# EAGLE design tamatebako (EAGLE 7.6.0)
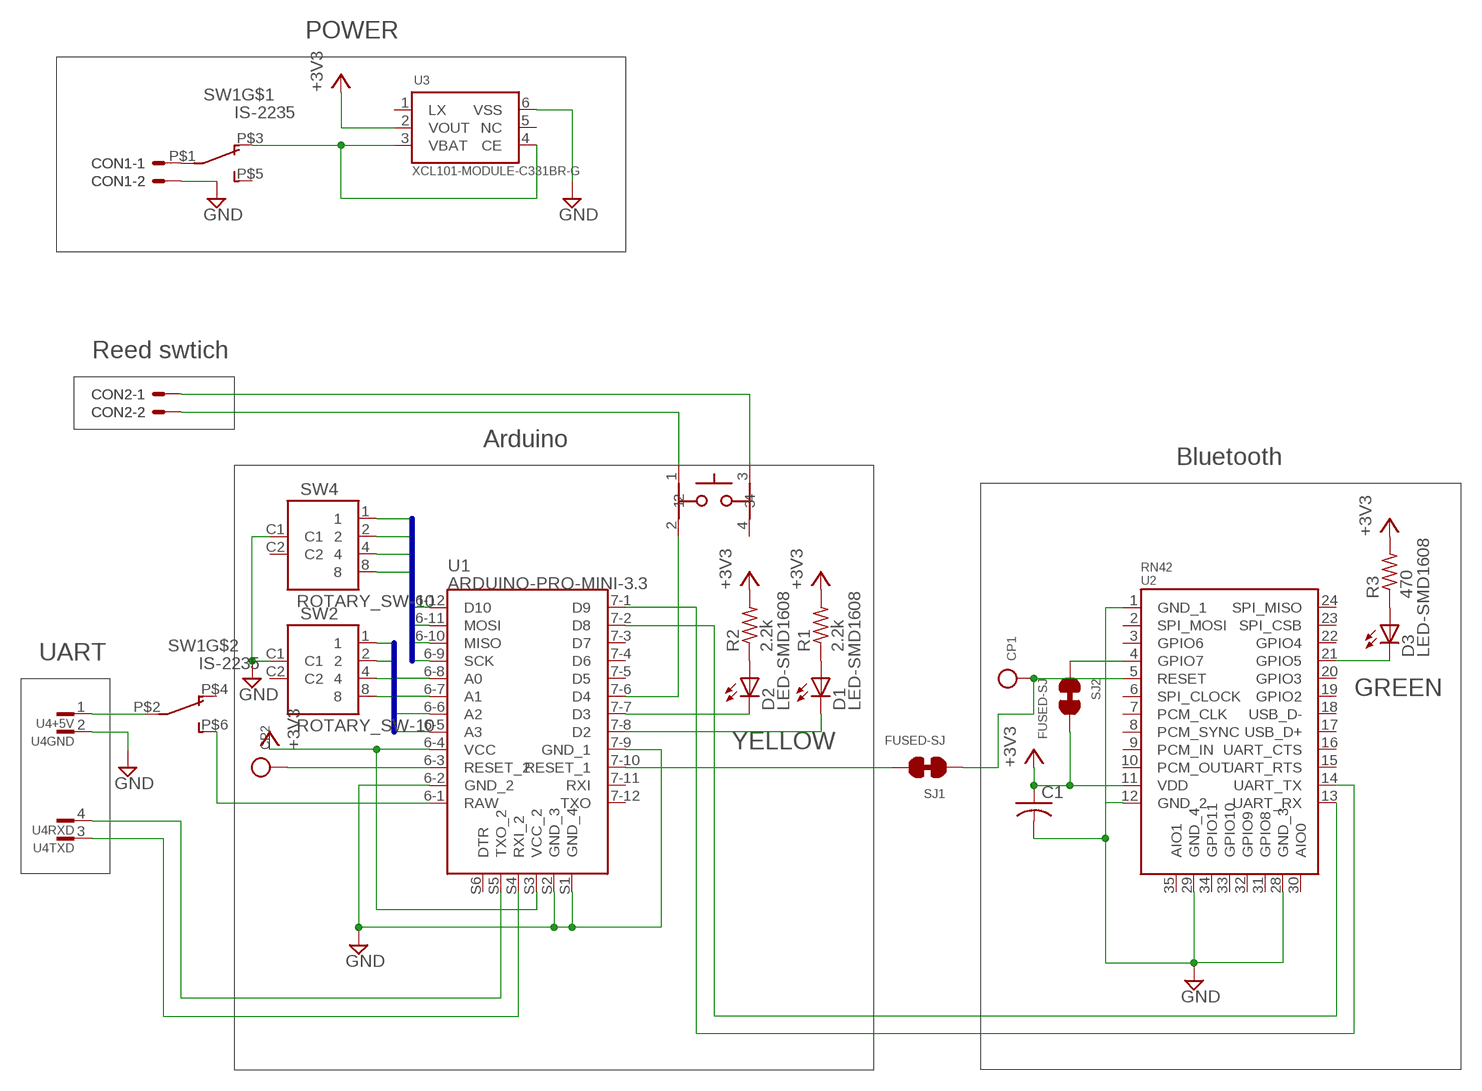
[diagram p0: schematic, sheet 1]

## Parts
C1  C-2012  [2012-C]
CON1  PH_CONNECTOR_2PIN  [PH_CONNECTOR_2PIN]
CON2  PH_CONNECTOR_2PIN  [PH_CONNECTOR_2PIN]
CP1  SST-1-2  [SST-1-2]
CP2  SST-1-2  [SST-1-2]
D1  LED-SMD1608  [D1608]
D2  LED-SMD1608  [D1608]
D3  LED-SMD1608  [D1608]
R1  2.2k  R-2012  [2012-R]
R2  2.2k  R-2012  [2012-R]
R3  470  R-2012  [2012-R]
SJ1  FUSED-SJ  [FUSED-SJ]
SJ2  FUSED-SJ  [FUSED-SJ]
SW1  IS-2235  [IS-2235]
SW2  ROTARY_SW-10  [ROTARY_SW]
SW3  PUSHSW  [PUSHSW]
SW4  ROTARY_SW-10  [ROTARY_SW]
U1  ARDUINO-PRO-MINI-3.3  [ARDUINO_PRO_MINI]
U2  RN42  [RN42]
U3  XCL101-MODULE-C331BR-G  [XCL101-MODULE]
U4  UART_MODULE  [MICRO_USB_SERIAL_MODULE]

## Nets
+3V3: C1.1 R1.2 R2.2 R3.2 SJ2.2 U1.6-4(VCC) U1.S3(VCC_2) U2.11(VDD) U3.2(VOUT)
GND: C1.2 CON1.2 SW2.C1 SW4.C1 U1.6-2(GND_2) U1.7-9(GND_1) U1.S1(GND_4) U1.S2(GND_3) U2.1(GND_1) U2.12(GND_2) U2.28(GND_3) U2.29(GND_4) U3.6(VSS) U4.2
LOWER0: SW2.1 U1.6-8(A0)
LOWER1: SW2.2 U1.6-7(A1)
LOWER2: SW2.4 U1.6-6(A2)
LOWER3: SW2.8 U1.6-5(A3)
N$1: CON1.1 SW1.P$1(P)
N$2: SW1.P$3(O) U3.3(VBAT) U3.4(CE)
N$3: CP1.1(SIGNAL) SJ1.1 U2.5(RESET)
N$4: U1.S5(TXO_2) U4.4
N$5: U1.7-1(D9) U2.14(UART_TX)
N$6: D1.A R1.1
N$7: D2.A R2.1
N$8: U1.S4(RXI_2) U4.3
N$9: SW1.P$2(P) U4.1
N$10: SW1.P$6(S) U1.6-1(RAW)
N$11: D2.K U1.7-7(D3)
N$12: D1.K U1.7-8(D2)
N$13: SW3.2 U1.7-6(D4)
N$14: CON2.2 SW3.1
N$15: CON2.1 SW3.3
N$16: SJ2.1 U2.4(GPIO7)
N$17: D3.A R3.1
N$18: D3.K U2.21(GPIO5)
N$19: U1.7-2(D8) U2.13(UART_RX)
RESET_ARDUINO: SJ1.2 U1.7-10(RESET_1)
RESET_ARDUINO_2: CP2.1(SIGNAL) U1.6-3(RESET_2)
UPPER0: SW4.1 U1.6-12(D10)
UPPER1: SW4.2 U1.6-11(MOSI)
UPPER2: SW4.4 U1.6-10(MISO)
UPPER3: SW4.8 U1.6-9(SCK)
Unconnected: SW1.P$4(O) SW1.P$5(S) SW2.C2 SW3.4 SW4.C2 U1.7-3(D7) U1.7-4(D6) U1.7-5(D5) U1.7-11(RXI) U1.7-12(TXO) U1.S6(DTR) U2.2(SPI_MOSI) U2.3(GPIO6) U2.6(SPI_CLOCK) U2.7(PCM_CLK) U2.8(PCM_SYNC) U2.9(PCM_IN) U2.10(PCM_OUT) U2.15(UART_RTS) U2.16(UART_CTS) U2.17(USB_D+) U2.18(USB_D-) U2.19(GPIO2) U2.20(GPIO3) U2.22(GPIO4) U2.23(SPI_CSB) U2.24(SPI_MISO) U2.30(AIO0) U2.31(GPIO8) U2.32(GPIO9) U2.33(GPIO10) U2.34(GPIO11) U2.35(AIO1) U3.1(LX) U3.5(NC)

## Buses
UPPER[0..3]
LOWER[0..3]

## Notes on the sheet
- POWER
- Reed swtich
- Arduino
- Bluetooth
- UART
- GREEN
- YELLOW

## Library data of the parts
C1 = Passive_Robotech:C
CON1 CON2 = Connector_Robotech:PH_CONNECTOR_2PIN: ph connector 2pin yeah
CP1 CP2 = Connector_Robotech:SST-1-2: Sunhayato logic checkpin SST-1-2
D1-D3 = Diode_Robotech:LED
R1-R3 = Passive_Robotech:R
SJ1 SJ2 = mylibrary:FUSED-SJ
SW1 = Passive_Robotech:IS-2235: 3-pin Slide Switch sold in akidzuki @100yen (2008/10/14)
SW2 SW4 = mylibrary:ROTARY_SW; RANGE: 0-9
SW3 = Passive_Robotech:PUSHSW
U1 = mylibrary:ARDUINO-PRO-MINI
U2 = mylibrary:RN42: Bluetooth module RN-42-I/RM by akizuki [link <http://akizukidenshi.com/catalog/g/gM-07612/>]
U3 = mylibrary:XCL101-MODULE
U4 = mylibrary:UART_MODULE

## Board
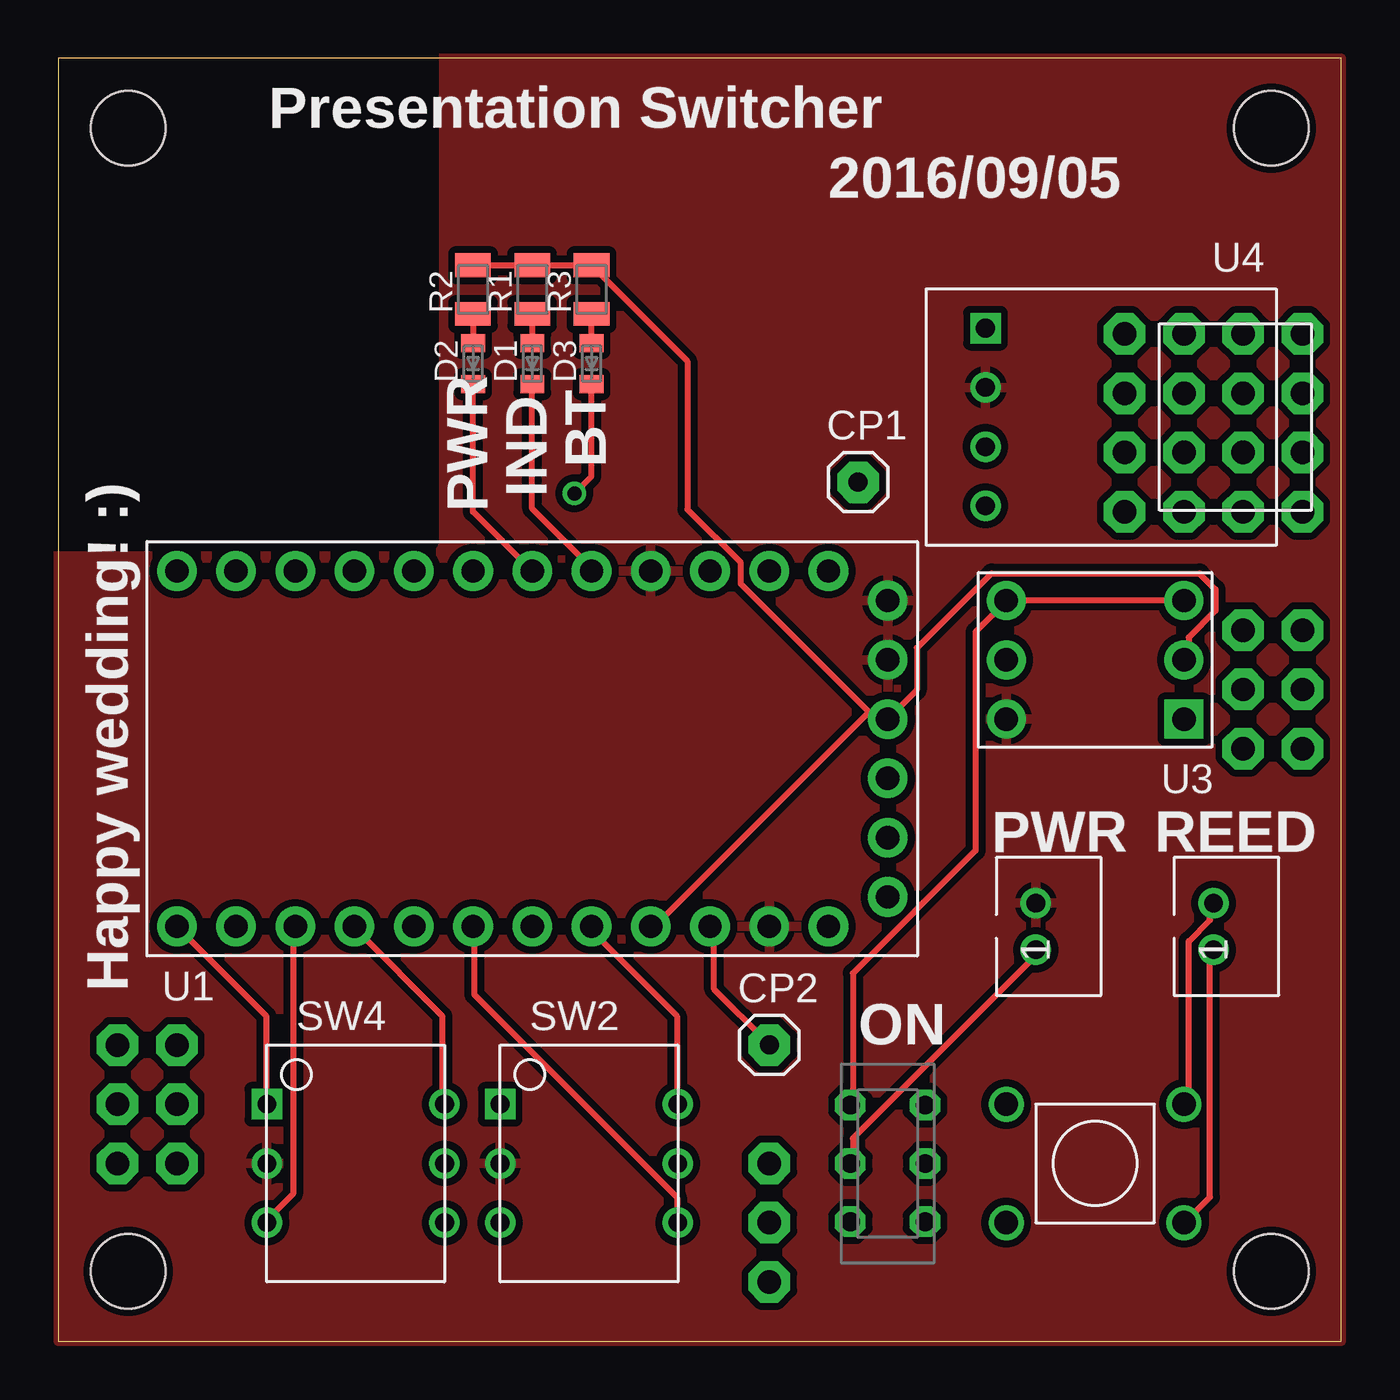
[diagram p1: board, top side]
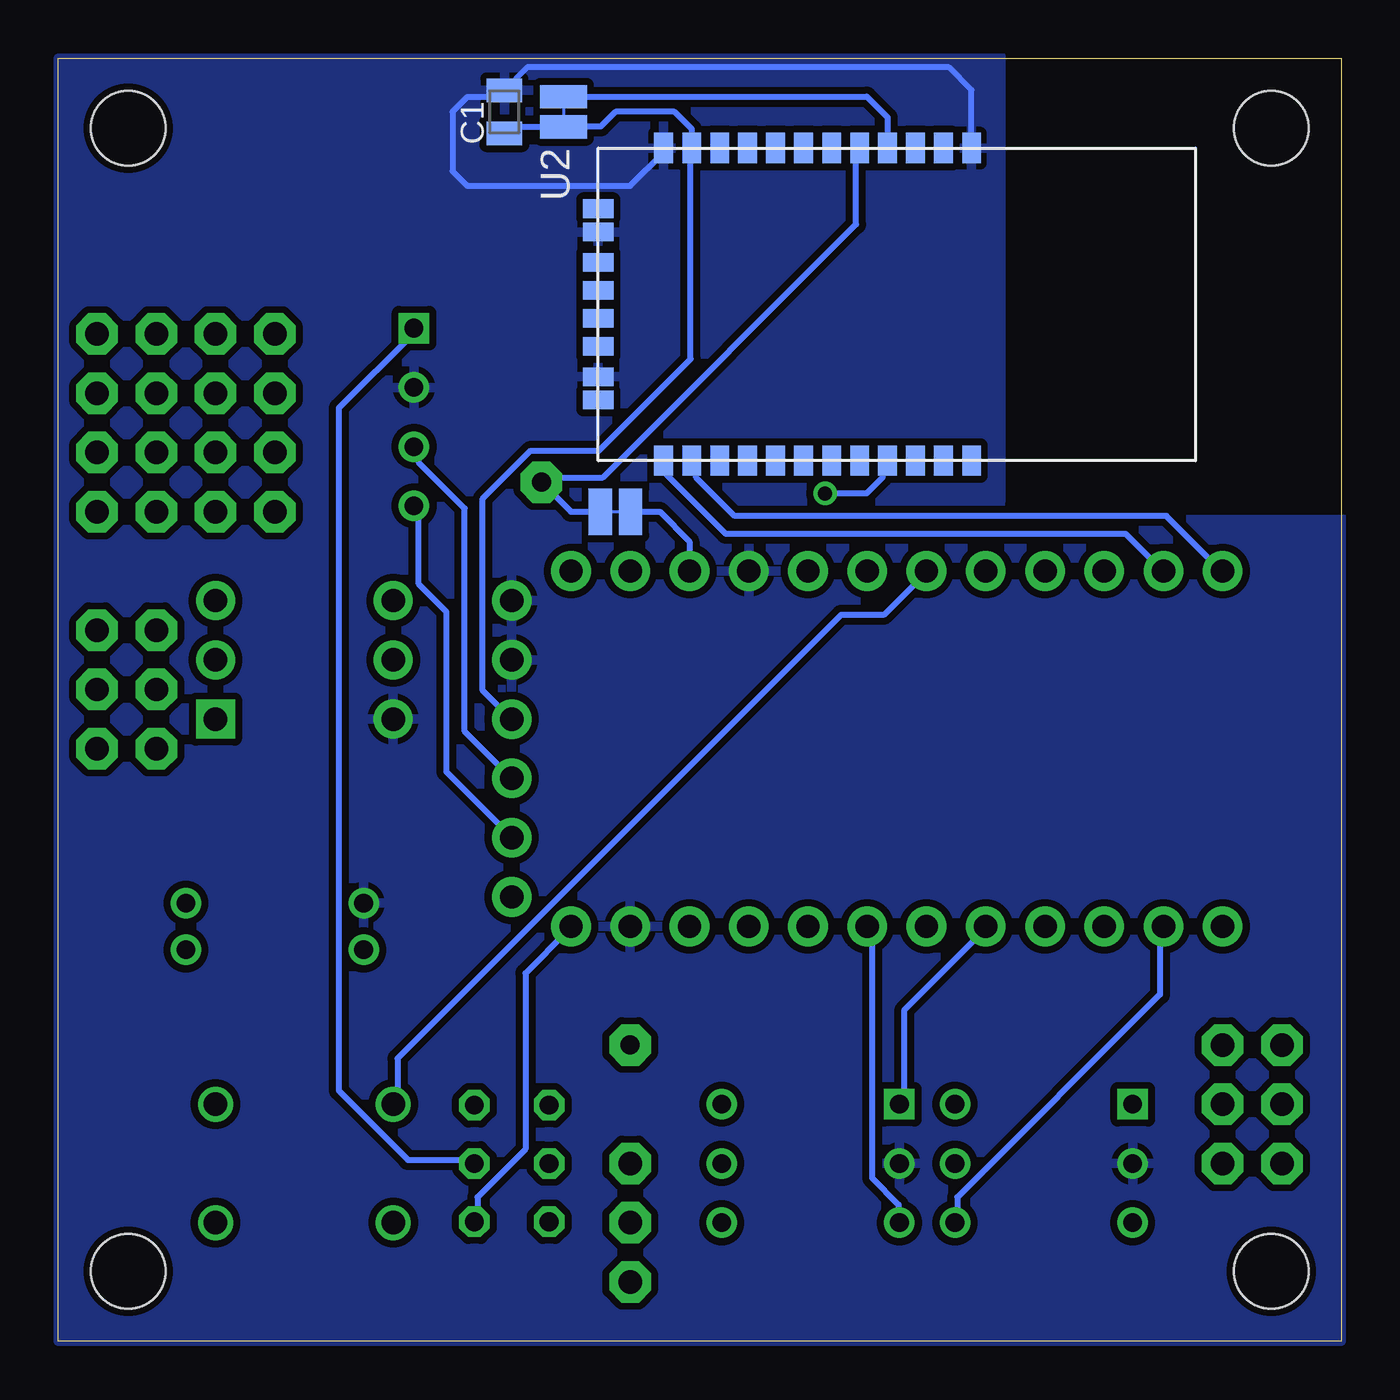
[diagram p2: board, bottom side, seen from below]

Size 55 x 55 mm. Coordinates in mm from the lower left corner, seen from the top.
Outline: 0,0 55,0 55,55 0,55 0,0
Copper layers (1*16): Top 0.0356mm / dielectric 1.5011mm / Bottom 0.0356mm
Design rules "formitaminimum": minimum track width 5mil, minimum drill 0.5994mm, track to track 0.2007mm, track to pad 0.2007mm, pad to pad 0.2007mm, via to via 0.2007mm, smd to smd 0mil, copper to edge 0mil, drill to drill 1mil, minimum pad ring 10mil, minimum via ring 8mil, stop-mask expansion 4mil, vias tented up to drill 0mil, thermal gap 10mil
Holes 3.2 mm at 3,3 52,3 52,52 3,52
tRestrict: area 0,34.3 to 15.9,55.2
bRestrict: area 0,35.9 to 14,55.2

### Footprints (pad centres in the part's own frame; a part is rotated, then mirrored left to right if it is on the bottom)
2012-C = smd 1.016 x 1.524: 1 -0.921,0; 2 0.921,0
PH_CONNECTOR_2PIN = drill 0.8: 1 -1,0; 2 1,0
SST-1-2 = drill 0.813 pad 1.778 octagon: 1 0,0
D1608 = smd 0.762 x 1.016: A 0.875,0; K -0.875,0
2012-R = smd 1.016 x 1.524: 1 -1.048,0; 2 1.048,0
FUSED-SJ = smd 1 x 2: 1 -0.65,0; 2 0.65,0
IS-2235 = drill 0.8 octagon: P$1 0,1.6; P$2 0,-1.6; P$3 2.5,1.6; P$4 2.5,-1.6; P$5 -2.5,1.6; P$6 -2.5,-1.6
ROTARY_SW = drill 0.8 square: 1 0,5.08 | drill 0.8: 2 7.62,0; 4 0,0; 8 7.62,5.08; C1 0,2.54; C2 7.62,2.54
PUSHSW = drill 1: 1 -2.54,3.81; 2 -2.54,-3.81; 3 2.54,3.81; 4 2.54,-3.81
ARDUINO_PRO_MINI = drill 1 pad 1.7: 6-1 -7.62,-11.43; 6-2 -7.62,-8.89; 6-3 -7.62,-6.35; 6-4 -7.62,-3.81; 6-5 -7.62,-1.27; 6-6 -7.62,1.27; 6-7 -7.62,3.81; 6-8 -7.62,6.35; 6-9 -7.62,8.89; 6-10 -7.62,11.43; 6-11 -7.62,13.97; 6-12 -7.62,16.51; 7-1 7.62,16.51; 7-2 7.62,13.97; 7-3 7.62,11.43; 7-4 7.62,8.89; 7-5 7.62,6.35; 7-6 7.62,3.81; 7-7 7.62,1.27; 7-8 7.62,-1.27; 7-9 7.62,-3.81; 7-10 7.62,-6.35; 7-11 7.62,-8.89; 7-12 7.62,-11.43; S1 6.35,-13.97; S2 3.81,-13.97; S3 1.27,-13.97; S4 -1.27,-13.97; S5 -3.81,-13.97; S6 -6.35,-13.97
RN42 = smd 1.3 x 0.8: 1 -6.7,3.2; 2 -6.7,2; 3 -6.7,0.8; 4 -6.7,-0.4; 5 -6.7,-1.6; 6 -6.7,-2.8; 7 -6.7,-4; 8 -6.7,-5.2; 9 -6.7,-6.4; 10 -6.7,-7.6; 11 -6.7,-8.8; 12 -6.7,-10; 13 6.7,-10; 14 6.7,-8.8; 15 6.7,-7.6; 16 6.7,-6.4; 17 6.7,-5.2; 18 6.7,-4; 19 6.7,-2.8; 20 6.7,-1.6; 21 6.7,-0.4; 22 6.7,0.8; 23 6.7,2; 24 6.7,3.2 | smd 0.8 x 1.3: 28 3.1,-12.8; 29 -3.1,-12.8; 30 4.1,-12.8; 31 1.8,-12.8; 32 0.6,-12.8; 33 -0.6,-12.8; 34 -1.8,-12.8; 35 -4.1,-12.8
XCL101-MODULE = drill 1 pad 1.676 square: 1 -3.81,2.54 | drill 1 pad 1.676: 2 -3.81,0; 3 -3.81,-2.54; 4 3.81,-2.54; 5 3.81,0; 6 3.81,2.54
MICRO_USB_SERIAL_MODULE = drill 0.8 square: 1 3.81,4.96 | drill 0.8: 2 1.27,4.96; 3 -1.27,4.96; 4 -3.81,4.96

### Placement (x,y rotation side)
C1  35.88,52.7 90 bottom
CON1  41.91,17.78 90 top
CON2  49.53,17.78 90 top
CP1  34.29,36.83 0 top
CP2  30.48,12.7 0 top
D1  20.32,41.91 90 top
D2  17.78,41.91 90 top
D3  22.86,41.91 90 top
R1  20.32,45.09 90 top
R2  17.78,45.09 90 top
R3  22.86,45.09 90 top
SJ1  31.11,35.56 0 bottom
SJ2  33.34,52.7 270 bottom
SW1  35.56,7.62 90 top
SW2  18.94,5.08 0 top
SW3  44.45,7.62 270 top
SW4  8.94,5.08 0 top
U1  21.59,25.4 90 top
U2  19.05,44.45 270 bottom
U3  44.45,29.21 180 top
U4  44.71,39.62 90 top

### Tracks (layer width: path | path; a pad name or v marks a point on that pad's centre or on a via)
+3V3
  Top 0.254: 34.75,26.98 29.26,32.46 29.26,33.38 26.98,35.66 26.98,42.02 R3.2 R1.2 R2.2 | U3.2 48.46,29.26 48.46,30.18 49.61,31.32 49.61,32.23 48.92,32.92 40.01,32.92 36.8,29.72 36.8,27.91 U1.S3 35.05,26.67 34.75,26.98 | 34.75,26.98 25.6,17.83 U1.6-4
  Bottom 0.254: U1.S3 35.66,26.75 36.8,27.89 36.8,36.12 34.75,38.18 31.83,38.18 27.89,42.11 27.89,50.98 27.85,51.02 U2.11 27.85,51.98 28.57,52.7 31.11,52.7 31.75,52.07 33.32,52.07 SJ2.2 35.61,52.05 C1.1
GND
  Bottom 0.254: 35.66,29.95 35.61,29.95 | U2.1 15.85,53.63 16.83,54.61 34.89,54.61 C1.2 36.16,53.34 37.47,53.34 38.1,52.7 38.1,50.16 37.47,49.53 30.48,49.53 29.05,50.96 U2.12
  pour Bottom (isolate 0.305): 0,55 55,55 55,0 0,0
  pour Top (isolate 0.305): 0,55 55,55 55,0 0,0
LOWER0
  Bottom 0.254: SW2.1 18.75,10.29 18.75,14.17 15.32,17.6 U1.6-8
LOWER1
  Top 0.254: SW2.2 26.52,5.26 26.52,6.17 17.83,14.86 17.83,17.6 U1.6-7
LOWER2
  Bottom 0.254: SW2.4 18.97,5.26 18.97,5.86 20.12,7 20.12,17.6 U1.6-6
LOWER3
  Top 0.254: SW2.8 26.52,10.29 26.52,13.95 22.86,17.6 U1.6-5
N$1
  Top 0.254: CON1.1 42.06,16.69 34.06,8.69 34.06,7.72 SW1.P$1
N$2
  Top 0.254: SW1.P$3 34.06,10.29 34.06,15.77 39.32,21.03 39.32,30.4 40.46,31.55 U3.4 40.69,31.77 48.23,31.77 U3.3
N$3
  Bottom 0.254: U2.5 20.8,50.98 20.8,47.88 31.65,37.03 34.29,37.03 CP1.1 33.02,35.56 SJ1.1
N$4
  Bottom 0.254: U4.4 39.55,35.66 39.55,32.46 38.35,31.27 38.35,24.41 35.56,21.61 U1.S5
N$5
  Bottom 0.254: U2.14 27.66,37.72 27.66,37.03 26.01,35.38 7.49,35.38 5.13,33.02 U1.7-1
N$6
  Top 0.254: R1.1 D1.A
N$7
  Top 0.254: R2.1 D2.A
N$8
  Bottom 0.254: U1.S4 37.58,26.15 37.58,35.7 39.55,37.67 39.55,38.18 U4.3
N$9
  Bottom 0.254: U4.1 39.78,43.2 42.98,40.01 42.98,10.74 40.01,7.77 37.31,7.77 SW1.P$2
N$10
  Bottom 0.254: U1.6-1 33.15,17.6 34.98,15.77 34.98,8.23 37.03,6.17 37.03,5.25 SW1.P$6
N$11
  Top 0.254: U1.7-7 17.78,35.56 D2.K
N$12
  Top 0.254: D1.K 20.32,35.69 22.86,33.15 U1.7-8
N$13
  Bottom 0.254: SW3.2 40.46,10.29 40.46,12.12 21.44,31.14 19.61,31.14 17.83,32.92 U1.7-6
N$14
  Top 0.254: CON2.2 49.38,18.75 49.38,18.06 48.46,17.14 48.46,10.29 SW3.1
N$15
  Top 0.254: CON2.1 49.38,16.69 49.38,6.17 48.46,5.26 SW3.3
N$16
  Bottom 0.254: 19.67,51.15 U2.4 19.45,52.47 20.34,53.35 SJ2.1
N$17
  Top 0.254: D3.A R3.1
N$18  (via drill 0.6)
  Top 0.254: v22.12,36.35 22.86,37.08 D3.K
  Bottom 0.254: v22.12,36.35 20.34,36.35 19.66,37.03 19.66,37.72 U2.21
N$19
  Bottom 0.254: U2.13 29.03,37.72 29.03,37.26 26.38,34.61 9.23,34.61 7.77,33.15 U1.7-2
N$20  (via drill 1 pad 1.78)
  other vias: 2.54,12.7
N$21  (via drill 1 pad 1.78)
  other vias: 5.08,12.7
N$22  (via drill 1 pad 1.78)
  other vias: 5.08,10.16
N$23  (via drill 1 pad 1.78)
  other vias: 2.54,10.16
N$24  (via drill 1 pad 1.78)
  other vias: 2.54,7.62
N$25  (via drill 1 pad 1.78)
  other vias: 5.08,7.62
N$26  (via drill 1 pad 1.78)
  other vias: 30.48,7.62
N$27  (via drill 1 pad 1.78)
  other vias: 30.48,5.08
N$28  (via drill 1 pad 1.78)
  other vias: 30.48,2.54
N$29  (via drill 1 pad 1.78)
  other vias: 53.34,30.48
N$30  (via drill 1 pad 1.78)
  other vias: 53.34,27.94
N$31  (via drill 1 pad 1.78)
  other vias: 53.34,25.4
N$32  (via drill 1 pad 1.78)
  other vias: 50.8,25.4
N$33  (via drill 1 pad 1.78)
  other vias: 50.8,27.94
N$34  (via drill 1 pad 1.78)
  other vias: 50.8,30.48
N$35  (via drill 1 pad 1.78)
  other vias: 45.72,43.18
N$36  (via drill 1 pad 1.78)
  other vias: 45.72,40.64
N$37  (via drill 1 pad 1.78)
  other vias: 45.72,38.1
N$38  (via drill 1 pad 1.78)
  other vias: 45.72,35.56
N$39  (via drill 1 pad 1.78)
  other vias: 48.26,35.56
N$40  (via drill 1 pad 1.78)
  other vias: 48.26,38.1
N$41  (via drill 1 pad 1.78)
  other vias: 48.26,40.64
N$42  (via drill 1 pad 1.78)
  other vias: 48.26,43.18
N$43  (via drill 1 pad 1.78)
  other vias: 50.8,43.18
N$44  (via drill 1 pad 1.78)
  other vias: 50.8,40.64
N$45  (via drill 1 pad 1.78)
  other vias: 50.8,38.1
N$46  (via drill 1 pad 1.78)
  other vias: 50.8,35.56
N$47  (via drill 1 pad 1.78)
  other vias: 53.34,35.56
N$48  (via drill 1 pad 1.78)
  other vias: 53.34,38.1
N$49  (via drill 1 pad 1.78)
  other vias: 53.34,40.64
N$50  (via drill 1 pad 1.78)
  other vias: 53.34,43.18
RESET_ARDUINO
  Bottom 0.254: SJ1.2 29.21,35.56 27.94,34.29 U1.7-10
RESET_ARDUINO_2
  Top 0.254: U1.6-3 28.12,17.6 28.12,15.09 30.4,12.8 CP2.1
UPPER0
  Top 0.254: U1.6-12 8.91,13.95 8.91,10.29 SW4.1
UPPER1
  Bottom 0.254: SW4.2 16.46,5.26 16.46,6.17 7.77,14.86 7.77,17.6 U1.6-11
UPPER2
  Top 0.254: SW4.4 9.14,5.26 9.14,5.4 10.06,6.32 10.06,17.6 U1.6-10
UPPER3
  Top 0.254: SW4.8 16.46,10.29 16.46,13.95 12.8,17.6 U1.6-9

### Text on the board
tPlace: Presentation Switcher | 2016/09/05 | Happy wedding! :) | ON
tNames: BT | PWR | IND | PWR | REED